# Altium schematic sheet dmpro16-pcb-v1-PowerSupply.SchDoc
size A4; DocumentNumber: 14; SheetNumber: 14; SheetTotal: 17; SheetName: PowerSupply
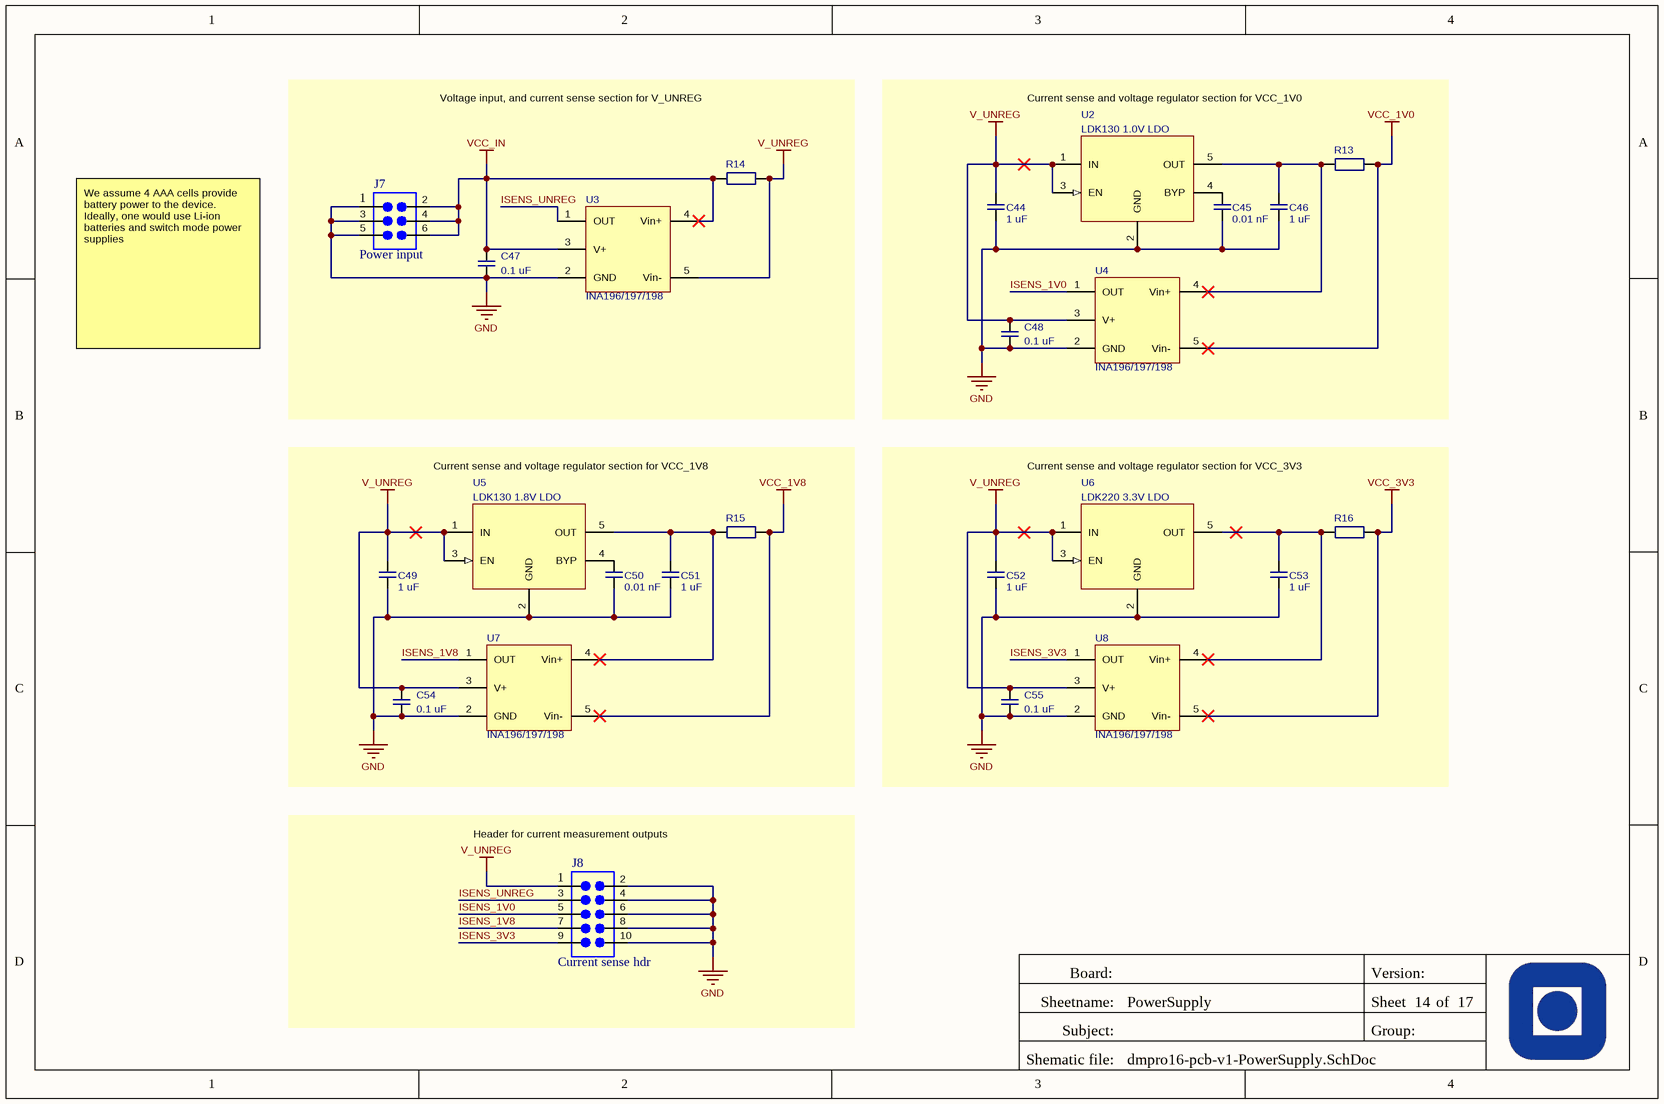
[diagram p0: dmpro16-pcb-v1-PowerSupply.SchDoc]

## Parts
C44  1 uF  [CAPC2012_0h50]
C45  0.01 nF  [CAPC2012_0h50]
C46  1 uF  [CAPC2012_0h50]
C47  0.1 uF  [CAPC2012_0h50]
C48  0.1 uF  [CAPC2012_0h50]
C49  1 uF  [CAPC2012_0h50]
C50  0.01 nF  [CAPC2012_0h50]
C51  1 uF  [CAPC2012_0h50]
C52  1 uF  [CAPC2012_0h50]
C53  1 uF  [CAPC2012_0h50]
C54  0.1 uF  [CAPC2012_0h50]
C55  0.1 uF  [CAPC2012_0h50]
J7  Power input  [HEADER_2X3]
J8  Current sense hdr  [HEADER_2X5]
R13  (no value)  [Resistor 3216]
R14  (no value)  [Resistor 3216]
R15  (no value)  [Resistor 3216]
R16  (no value)  [Resistor 3216]
U2  LDK130 1.0V LDO  [SOT23-5-127P600-8N]
U3  INA196/197/198  [SOT23-5-127P600-8N]
U4  INA196/197/198  [SOT23-5-127P600-8N]
U5  LDK130 1.8V LDO  [SOT23-5-127P600-8N]
U6  LDK220 3.3V LDO  [SOT23-5-127P600-8N]
U7  INA196/197/198  [SOT23-5-127P600-8N]
U8  INA196/197/198  [SOT23-5-127P600-8N]

## Nets
GND: C44.1 C45.1 C46.1 C47.1 C48.1 C49.1 C50.1 C51.1 C52.1 C53.1 C54.1 C55.1 J7.1 J7.3 J7.5 J8.2 J8.4 J8.6 J8.8 J8.10 U2.2(GND) U3.2(GND) U4.2(GND) U5.2(GND) U6.2(GND) U7.2(GND) U8.2(GND)
V_UNREG: C44.2 C48.2 C49.2 C52.2 C54.2 C55.2 J8.1 R14.1 U2.1(IN) U2.3(EN) U3.5(Vin-) U4.3(V+) U5.1(IN) U5.3(EN) U6.1(IN) U6.3(EN) U7.3(V+) U8.3(V+)
VCC_1V0: R13.1 U4.5(Vin-)
VCC_1V8: R15.1 U7.5(Vin-)
VCC_3V3: R16.1 U8.5(Vin-)
VCC_IN: C47.2 J7.2 J7.4 J7.6 R14.2 U3.3(V+) U3.4(Vin+)
ISENS_1V0: J8.5 U4.1(OUT)
ISENS_1V8: J8.7 U7.1(OUT)
ISENS_3V3: J8.9 U8.1(OUT)
ISENS_UNREG: J8.3 U3.1(OUT)
NetC45_2: C45.2 U2.4(BYP)
NetC46_2: C46.2 R13.2 U2.5(OUT) U4.4(Vin+)
NetC50_2: C50.2 U5.4(BYP)
NetC51_2: C51.2 R15.2 U5.5(OUT) U7.4(Vin+)
NetC53_2: C53.2 R16.2 U6.5(OUT) U8.4(Vin+)

Not connected (* = marked no-connect by the designer): U6 4(NC)

## Notes on the sheet
- We assume 4 AAA cells provide battery power to the device. Ideally, one would use Li-ion batteries and switch mode power supplies
- Voltage input, and current sense section for V_UNREG
- Current sense and voltage regulator section for VCC_1V0
- Current sense and voltage regulator section for VCC_1V8
- Current sense and voltage regulator section for VCC_3V3
- (near J8) Header for current measurement outputs
- Board:
- Version:
- Sheetname:
- Subject:
- Group:
- Sheet
- of
- Shematic file:

## Library data of the parts
C44 C46 C49 C51-C53 = cap_unpol_1608_1uF: 1 uF unpolarized capacitor (1608 size); Voltage Rating: 6.3 V; Body Size (metric): 1608; Ideal Value: 1 uF
C45 C50 = cap_unpol_1608_0.01uF: 0.01 uF unpolarized capacitor (1608 size); Voltage Rating: 6.3 V; Body Size (metric): 1608; Ideal Value: 0.01 nF
C47 C48 C54 C55 = cap_unpol_1608_0.1uF: 0.1 uF unpolarized capacitor (1608 size); Voltage Rating: 6.3 V; Body Size (metric): 1608; Ideal Value: 0.1 uF
J7 = con_head_2x03pin: Header 2x03pin
J8 = con_head_2x05pin: Header 2x05pin
R13-R16 = res_currentsense: Current sense resistor; Watt rating: ? mW
U2 = ic_vreg_ldo_1v0_ldk130m10r: Output Voltage: 1.0 V
U3 U4 U7 U8 = ic_currentsense_ina196/197/198
U5 = ic_vreg_ldo_1v8_ldk130m18r: Output Voltage: 1.8 V
U6 = ic_vreg_ldo_3v3_ldk220m33r: Output Voltage: 3.3 V